# EAGLE design SmartMeter (EAGLE 9.2.0)
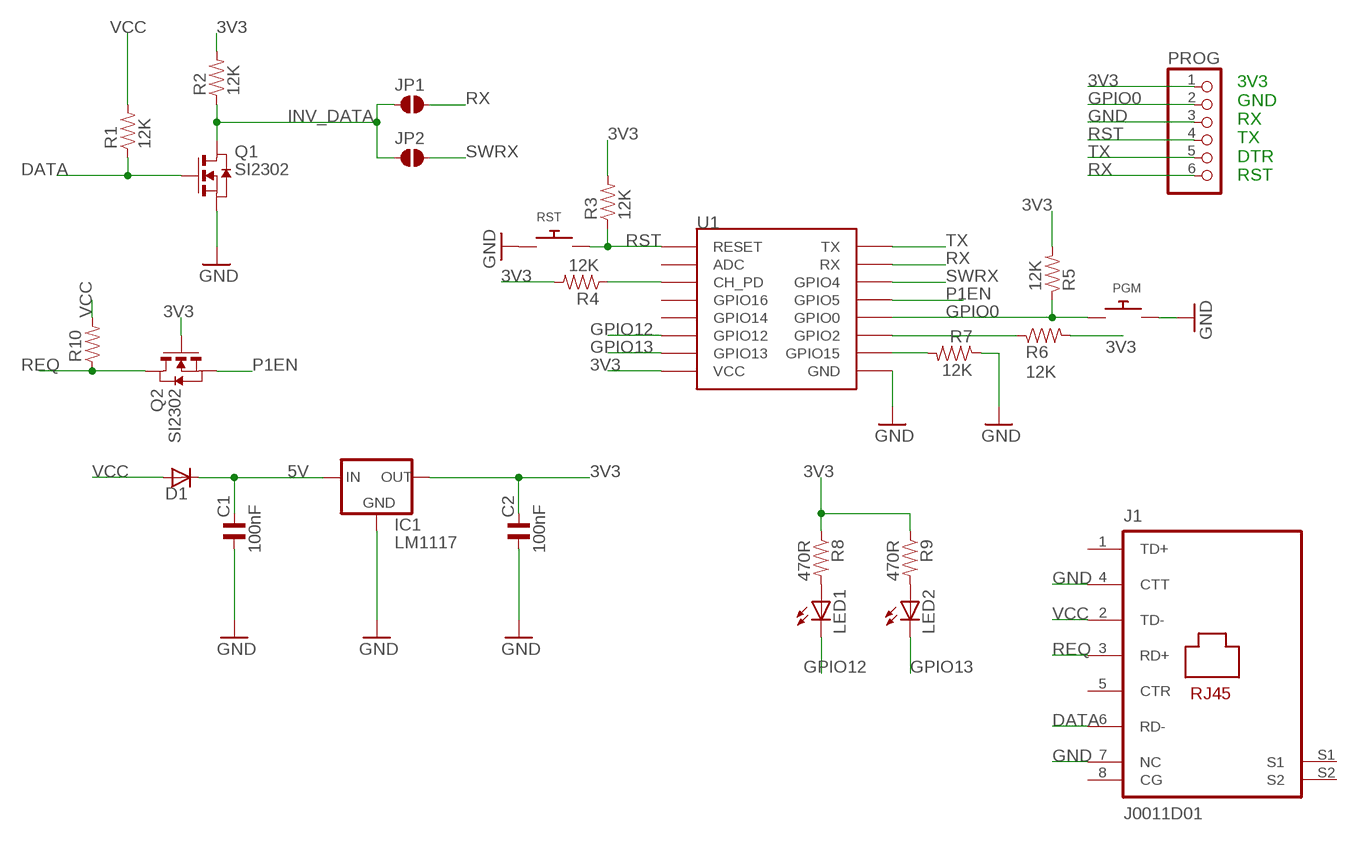
[diagram p0: schematic, sheet 1]

## Parts
C1  100nF  C_0805MP  [C0805MP]
C2  100nF  C_0805MP  [C0805MP]
D1  DIODE_SOD-123FL  [SOD-123FL]
IC1  LM1117  [SOT223]
J1  J0011D01  [J0-C/D/E]
JP1  SJ-035  [SJ-035]
JP2  SJ-035  [SJ-035]
LED1  LEDCHIPLED_0805  [CHIPLED_0805]
LED2  LEDCHIPLED_0805  [CHIPLED_0805]
PGM  SWITCH_PUSHBUTTONC&K_KSS  [BTN_CK_KSS]
PROG  PINHD-1X6B  [1X06-BIG]
Q1  SI2302  NMOSSOT23  [SOT-23]
Q2  SI2302  NMOSSOT23  [SOT-23]
R1  12K  RESISTOR0805_RES  [0805_RES]
R2  12K  RESISTOR0805_RES  [0805_RES]
R3  12K  RESISTOR0805_RES  [0805_RES]
R4  12K  RESISTOR0805_RES  [0805_RES]
R5  12K  RESISTOR0805_RES  [0805_RES]
R6  12K  RESISTOR0805_RES  [0805_RES]
R7  12K  RESISTOR0805_RES  [0805_RES]
R8  470R  RESISTOR0805_RES  [0805_RES]
R9  470R  RESISTOR0805_RES  [0805_RES]
R10  RESISTOR0805_RES  [0805_RES]
RST  SWITCH_PUSHBUTTONC&K_KSS  [BTN_CK_KSS]
U1  ESP12  [ESP12]

## Nets
3V3: C2.2 IC1.2(OUT) PROG.1 Q2.3(G) R2.2 R3.2 R4.2 R5.2 R6.2 R8.1 R9.1 U1.VCC
5V: C1.2 D1.C IC1.3(IN)
DATA: J1.6(RD-) Q1.3(G) R1.1
GND: C1.1 C2.1 IC1.1(GND) J1.4(CTT) J1.7(NC) PGM.P$1 PROG.3 Q1.2(S) R7.1 RST.P$1 U1.GND
GPIO0: PGM.P$2 PROG.2 R5.1 U1.GPIO0
GPIO12: LED1.C U1.GPIO12
GPIO13: LED2.C U1.GPIO13
INV_DATA: JP1.1 JP2.1 Q1.1(D) R2.1
N$1: R4.1 U1.CH_PD
N$2: R7.2 U1.GPIO15
N$3: R6.1 U1.GPIO2
N$4: LED1.A R8.2
N$5: LED2.A R9.2
P1EN: Q2.2(S) U1.GPIO5
REQ: J1.3(RD+) Q2.1(D) R10.1
RST: PROG.4 R3.1 RST.P$2 U1.RESET
RX: JP1.2 PROG.6 U1.RX
SWRX: JP2.2 U1.GPIO4
TX: PROG.5 U1.TX
VCC: D1.A J1.2(TD-) R1.2 R10.2
Unconnected: J1.1(TD+) J1.5(CTR) J1.8(CG) J1.S1 J1.S2 U1.ADC U1.GPIO14 U1.GPIO16

## Notes on the sheet
- 3V3
  GND
  RX
  TX
  DTR
  RST

## Library data of the parts
C1 C2 = rc-master-smd:C_: NON-POLARIZED CAP
D1 = adafruit:DIODE: Diode SMADIODE - SMA Surface Mount Package 20V 1A Schottky Diode Digikey: 641-1014-6-ND DO-1N4148 - Through Hole Small Current Diode SOD-123 20V 1 A (.5mV Vf) Schottky Diode - Digikey: MBRX120TPMSCT-ND SOD-323 10V 570mA (.38mV Vf, 3ns) Schottky Diode - Digikey: ZLLS410CT-ND SOD-523 30V 30mA Schottky Diode (RB751S-40TE61) - Digikey: RB751S-40TE61CT-ND SOT23-R/W - SOT23 Package (R = Solder Paste/Reflow Ovens, W = Hand-Soldering) BAT54Film 40V 300mA - Digikey: 497-7162-1-ND
IC1 = v-reg-3:LM1117
J1 = pulse-eng:J0011D01: RJ45 PulseJack; SPICEPREFIX: X
JP1 JP2 = jumpers:SJ-: Solder Jumper
LED1 LED2 = adafruit:LED: LED OSRAM: - CHIPLED LG R971, LG N971, LY N971, LG Q971, LY Q971, LO R971, LY R971 LH N974, LH R974 LS Q976, LO Q976, LY Q976 LO Q996 - Hyper CHIPLED LW Q18S LB Q993, LB Q99A, LB R99A - SideLED LS A670, LO A670, LY A670, LG A670, LP A670 LB A673, LV A673, LT A673, LW A673 LH A674 LY A675 LS A676, LA A676, LO A676, LY A676, LW A676 LS A679, LY A679, LG A679 - Hyper Micro SIDELED® LS Y876, LA Y876, LO Y876, LY Y876 LT Y87S - SmartLED LW L88C, LW L88S LB L89C, LB L89S, LG L890 LS L89K, LO L89K, LY L89K LS L896, LA L896, LO L896, LY L896 - TOPLED LS T670, LO T670, LY T670, LG T670, LP T670 LSG T670, LSP T670, LSY T670, LOP T670, LYG T670 LG T671, LOG T671, LSG T671 LB T673, LV T673, LT T673, LW T673 LH T674 LS T676, LA T676, LO T676, LY T676, LB T676, LH T676, LSB T676, LW T676 LB T67C, LV T67C, LT T67C, LS T67K, LO T67K, LY T67K, LW E67C LS E67B, LA E67B, LO E67B, LY E67B, LB E67C, LV E67C, LT E67C LW T67C LS T679, LY T679, LG T679 LS T770, LO T770, LY T770, LG T770, LP T770 LB T773, LV T773, LT T773, LW T773 LH T774 LS E675, LA E675, LY E675, LS T675 LS T776, LA T776, LO T776, LY T776, LB T776 LHGB T686 LT T68C, LB T68C - Hyper Mini TOPLED® LB M676 - Mini TOPLED Santana® LG M470 LS M47K, LO M47K, LY M47K Source: http://www.osram.convergy.de/
PGM RST = adafruit:SWITCH_PUSHBUTTON: Buttons SOFTTOUCHSMD_SJ - Soft touch temporary push button (Super Junk Akihabara) Compatible with SKPMANE010 [Mouser: 688-SKPMAN] C&K_KSS = Digikey: KSS221GLFS
PROG = adafruit:PINHD-1X6: PIN HEADER
Q1 Q2 = epic:NMOSSOT23: MOS FET
R1-R10 = passives:RESISTOR: Resistor Basic schematic elements and footprints for 0603, 1206, and PTH resistors.
U1 = esp8266modules:ESP12: ESP8266 Wifi module 12

## Board
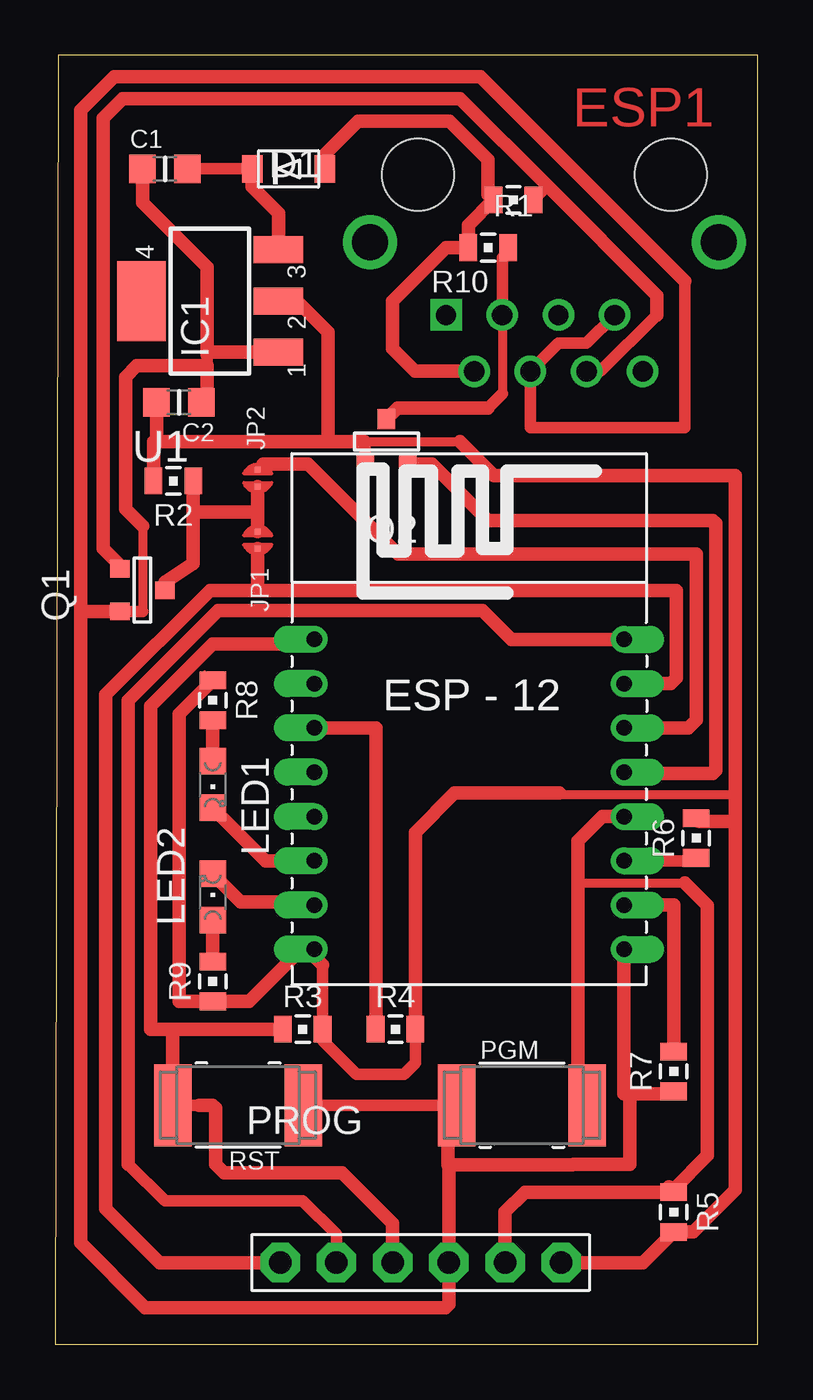
[diagram p1: board, top side]
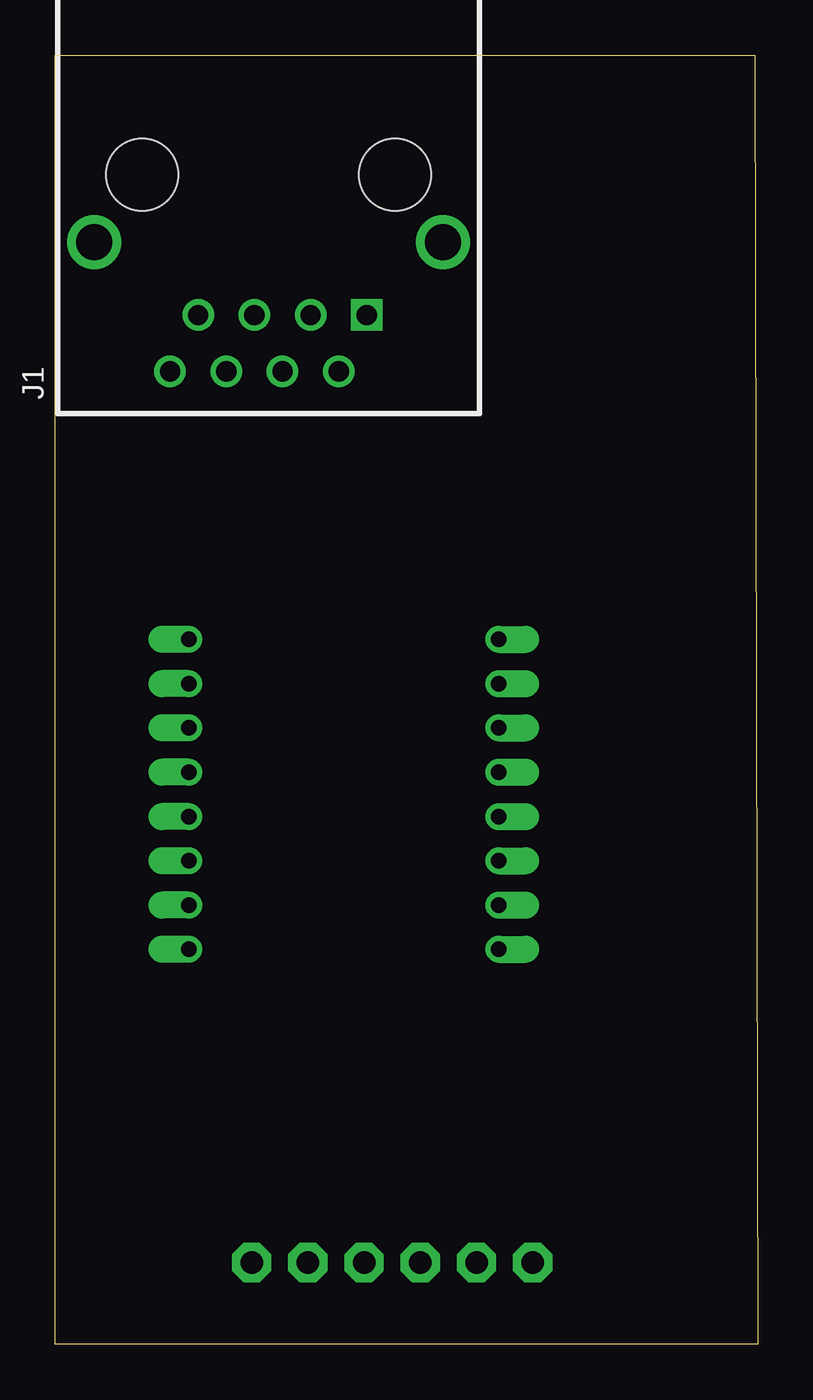
[diagram p2: board, bottom side, seen from below]

Size 31.73 x 58.22 mm. Coordinates in mm from the lower left corner, seen from the top.
Outline: 0,0 31.73,0 31.73,58.22 0.13,58.22 0,0
Copper layers (1*16): Top 0.035mm / dielectric 1.5mm / Bottom 0.035mm
Design rules "default": minimum track width 6mil, minimum drill 0.35mm, track to track 6mil, track to pad 6mil, pad to pad 6mil, via to via 6mil, smd to smd 6mil, copper to edge 40mil, drill to drill 6mil, minimum pad ring 10mil, minimum via ring 8mil, stop-mask expansion 4mil, vias tented up to drill 0mil, thermal gap 10mil

### Footprints (pad centres in the part's own frame; a part is rotated, then mirrored left to right if it is on the bottom)
C0805MP = smd 1.2 x 1.3: 1 -1.016,0; 2 1.016,0
SOD-123FL = smd 0.91 x 1.22: A 1.637,0; C -1.637,0
SOT223 = smd 1.219 x 2.235: 1 -2.311,-3.099; 2 0,-3.099; 3 2.311,-3.099 | smd 3.6 x 2.2: 4 0,3.099
J0-C/D/E = drill 0.914 square: 1 4.445,-6.35 | drill 0.914: 2 3.175,-8.89; 3 1.905,-6.35; 4 0.635,-8.89; 5 -0.635,-6.35; 6 -1.905,-8.89; 7 -3.175,-6.35; 8 -4.445,-8.89 | drill 1.626: S1 -7.874,-3.048; S2 7.874,-3.048 | hole 3.251: -5.715,0; 5.715,0
SJ-035 = smd 0.254 x 0.254: 1 -0.381,0; 2 0.381,0
CHIPLED_0805 = smd 1.2 x 1.2: A 0,-1.05; C 0,1.05
BTN_CK_KSS = smd 1.7 x 3.7: P$1 -2.95,0; P$2 2.95,0
1X06-BIG = drill 1.016 pad 1.778 octagon: 1 -6.35,0; 2 -3.81,0; 3 -1.27,0; 4 1.27,0; 5 3.81,0; 6 6.35,0
SOT-23 = smd 0.787 x 0.889: 1 0.025,-1.016; 2 -0.94,1.016; 3 0.991,1.016
0805_RES = smd 0.8 x 1.2: 1 -0.9,0; 2 0.9,0
ESP12 = drill 0.7 offset: ADC -7.1,3.8; CH_PD -7.1,1.8; GND 6.9,-8.2; GPIO0 6.9,-2.2; GPIO2 6.9,-4.2; GPIO4 6.9,1.8; GPIO5 6.9,-0.2; GPIO12 -7.1,-4.2; GPIO13 -7.1,-6.2; GPIO14 -7.1,-2.2; GPIO15 6.9,-6.2; GPIO16 -7.1,-0.2; RESET -7.1,5.8; RX 6.9,3.8; TX 6.9,5.8; VCC -7.1,-8.2

### Placement (x,y rotation side)
C1  4.95,53.09 0 top
C2  5.59,42.55 180 top
D1  10.54,53.09 0 top
IC1  6.98,47.12 90 top
J1  22.1,52.83 0 bottom
JP1  9.14,36.32 270 top
JP2  9.14,39.12 90 top
LED1  7.11,25.27 180 top
LED2  7.11,20.19 0 top
PGM  21.08,10.79 0 top
PROG  16.51,3.68 180 top
Q1  3.94,34.04 90 top
Q2  14.99,40.77 180 top
R1  20.7,51.69 180 top
R2  5.33,38.99 180 top
R3  11.18,14.22 0 top
R4  15.37,14.22 0 top
R5  27.94,5.97 270 top
R6  28.96,22.86 90 top
R7  27.94,12.32 90 top
R8  7.11,29.08 270 top
R9  7.11,16.38 90 top
R10  19.56,49.53 180 top
RST  8.26,10.79 180 top
U1  18.8,26.04 0 top

### Tracks (layer width: path | path; a pad name or v marks a point on that pad's centre or on a via)
3V3
  Top 0.152: U1.VCC 11.54,17.68 11.51,17.65 | R8.1 6.74,30.35 | 5.08,42.55 C2.2 | 9.7,46.74 IC1.2 10.34,47.37 10.67,47.37 | R3.2 12.08,13.72 | 22.86,24.82 22.78,24.89 | R6.2 29.09,23.62 | 4.57,40.91 4.43,40.77 | 14,40.74 13.97,40.77
  Top 0.406: 30.73,24.82 22.86,24.82 22.55,24.82 | 13.97,40.77 18.29,40.77
  Top 0.508: 30.73,23.35 30.73,23.11 | 12.08,17.13 R3.2 | 12.08,13.72 13.6,12.19 15.75,12.19 16.27,12.71 R4.2 | Q2.3 14,40.74
  Top 0.61: 11.51,17.65 10.92,17.65 8.75,15.48 R9.1 5.59,15.48 5.59,28.46 R8.1 | R2.2 4.43,40.77 12.32,40.77 | 12.08,17.13 11.54,17.68 | R4.2 16.27,23.12 18.03,24.89 22.78,24.89 | 30.73,23.62 30.73,23.11 30.73,6.97 28.83,5.07 R5.2 26.55,3.68 PROG.1 | 30.73,23.62 30.73,24.82 30.73,39.24 19.81,39.24 18.29,40.77 | 29.09,23.62 30.73,23.62 | 12.32,40.77 12.32,45.72 10.67,47.37 | C2.2 4.57,40.91 | 12.32,40.77 13.97,40.77
  Bottom 0.152: U1.VCC 11.63,17.75
5V
  Top 0.152: IC1.3 10.03,49.3 | IC1.3 10.03,49.45 | IC1.3 9.98,49.53
  Top 0.508: D1.C 8.89,53.09 C1.2
  Top 0.61: IC1.3 10.08,51.1 8.89,52.29 8.89,53.09
DATA
  Top 0.152: 2.92,35.18 Q1.3 | 21.73,51.56 R1.1
  Top 0.508: 27.18,46.48 24.64,43.94 J1.6 | 22.23,52.32 R1.1
  Top 0.61: 27.18,46.48 27.18,47.37 22.23,52.32 18.29,56.26 3.05,56.26 2.16,55.37 2.16,35.94 2.92,35.18
GND
  Top 0.152: U1.GND 25.65,17.75 | R7.1 27.82,11.3 | 10.19,44.7 IC1.1 | 23.4,8.13 23.37,8.1 | PGM.P$1 17.75,10.42 | 6.86,42.55 6.86,42.29 | 6.96,44.81 6.86,44.7 | 1.22,33.1 1.14,33.02 | 17.78,8.07 17.75,8.1
  Top 0.406: 3.94,36.96 3.94,33.1
  Top 0.508: 25.95,11.3 25.7,11.3 | 23.59,8.1 23.37,8.1 | J1.7 24,45.21 22.73,45.21 J1.4 21.46,41.4 28.45,41.4 28.45,48.01 | 6.86,42.55 C2.1 6.35,42.55 | PGM.P$1 RST.P$1 | 6.86,44.7 6.86,44.2 | 3.94,33.1 Q1.2 | 17.78,1.81 17.62,1.65
  Top 0.61: 23.4,8.13 25.95,8.13 25.95,11.3 27.82,11.3 | U1.GND 25.7,11.3 | 23.37,8.1 17.75,8.1 17.75,10.42 | 17.62,1.65 4.06,1.65 1.14,4.57 1.14,33.02 1.14,55.73 2.67,57.25 19.2,57.25 28.45,48.01 | C1.1 3.94,51.56 6.86,48.64 6.86,44.7 | 6.86,42.55 6.86,44.2 3.68,44.2 3.17,43.69 3.17,37.72 3.94,36.96 | IC1.1 6.96,44.81 | Q1.2 1.22,33.1 | 17.78,8.07 PROG.3 17.78,1.81
  Bottom 0.152: 25.81,17.91 U1.GND
GPIO0
  Top 0.152: PGM.P$2 23.62,11.21 | 27.93,6.86 R5.1
  Top 0.406: 23.62,20.83 28.45,20.83
  Top 0.508: 27.94,7 R5.1
  Top 0.61: U1.GPIO0 24.72,23.84 23.62,22.73 23.62,20.83 23.62,11.21 | R5.1 27.71,7.1 | 27.94,7 29.46,8.52 29.46,19.43 29.46,19.81 28.45,20.83 | PROG.2 20.32,5.97 21.21,6.86 27.93,6.86
GPIO12
  Top 0.61: U1.GPIO12 9.5,21.84 LED1.C
GPIO13
  Top 0.152: U1.GPIO13 11.56,19.97
  Top 0.61: 11.56,19.97 8.38,19.97 LED2.C
INV_DATA
  Top 0.152: R2.1 6.23,38.48
  Top 0.508: Q1.1 4.95,34.42
  Top 0.61: 4.95,34.42 6.23,35.25 6.23,37.59 | R2.1 6.23,37.59 | JP2.1 9.14,37.59 | 9.14,37.59 JP1.1 | 9.14,37.59 6.23,37.59
N$1
  Top 0.152: 14.5,14.26 R4.1
  Top 0.61: U1.CH_PD 14.5,27.84 14.5,14.26
N$2
  Top 0.61: U1.GPIO15 27.94,19.84 R7.2
N$3
  Top 0.152: 29.08,21.84 R6.1
  Top 0.508: R6.1 28.83,21.84 U1.GPIO2
N$4
  Top 0.61: R8.2 LED1.A
N$5
  Top 0.61: LED2.A R9.2
P1EN
  Top 0.152: 25.75,25.78 U1.GPIO5
  Top 0.508: 29.72,37.21 29.84,37.08 | 29.84,25.91 29.72,25.78
  Top 0.61: Q2.2 17.02,39.75 19.56,37.21 29.72,37.21 | 29.84,37.08 29.84,25.91 | 29.72,25.78 25.75,25.78
REQ
  Top 0.152: 20.19,49.08 20.55,49.44
  Top 0.406: J1.3 20.19,42.93 | 15.21,42.04 Q2.1
  Top 0.508: 20.55,49.44 R10.1 | 20.19,42.93 19.56,42.29 | J1.3 20.19,49.08
  Top 0.61: 19.56,42.29 15.47,42.29 15.21,42.04
RST
  Top 0.152: U1.RESET 11.48,31.62 | 5.46,14.22 5.3,14.07
  Top 0.508: RST.P$2 6.51,10.79 | 7.11,10.79 7.24,10.67
  Top 0.61: R3.1 5.46,14.22 4.32,14.22 4.32,28.83 7.11,31.62 11.48,31.62 | 5.3,14.07 RST.P$2 | PROG.4 15.24,5.46 12.95,7.75 7.62,7.75 7.24,8.13 7.24,10.67 | 6.51,10.79 7.11,10.79
RX
  Top 0.61: 9.14,34.04 28.07,34.04 28.07,30.1 27.8,29.84 U1.RX | 9.14,34.04 6.98,34.04 2.29,29.34 2.29,6.11 4.71,3.68 PROG.6 | JP1.2 9.14,34.04
  Bottom 0.152: U1.RX 25.65,29.95
SWRX
  Top 0.508: 9.4,39.75 JP2.2
  Top 0.61: U1.GPIO4 28.6,27.84 28.96,28.19 28.96,35.69 15.49,35.69 11.43,39.75 9.4,39.75
TX
  Top 0.508: U1.TX 25.65,31.88 | 3.3,8.13 4.95,6.48 11.18,6.48 12.7,4.95 PROG.5
  Top 0.61: 3.3,8.13 3.3,29.08 7.37,33.15 19.3,33.15 20.62,31.84 U1.TX
  Bottom 0.152: U1.TX 25.65,31.77
VCC
  Top 0.152: R10.2 18.53,49.4 | D1.A 12.18,53.74 | 19.56,51.93 R1.2
  Top 0.61: J1.2 16.26,43.94 15.24,44.96 15.24,47.12 17.65,49.53 R10.2 18.66,50.55 R1.2 | 12.18,53.74 13.68,55.24 17.81,55.24 19.56,53.5 19.56,51.93

### Text on the board
Top: ESP1